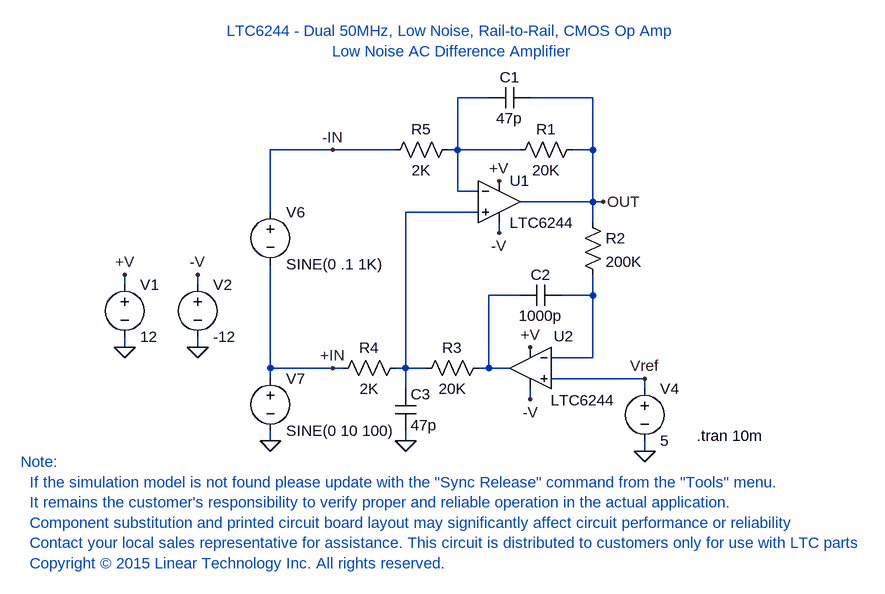
[diagram p0: schematic LTC6244_F11A.asc]
LTC6244_F11A.asc, the LTspice schematic file:
Version 4
SHEET 1 1080 868
WIRE 112 128 64 128
WIRE 272 128 176 128
WIRE -128 208 -224 208
WIRE -32 208 -128 208
WIRE 64 208 64 128
WIRE 64 208 48 208
WIRE 160 208 64 208
WIRE 272 208 272 128
WIRE 272 208 240 208
WIRE 64 272 64 208
WIRE 96 272 64 272
WIRE 272 288 272 208
WIRE 272 288 160 288
WIRE 288 288 272 288
WIRE -224 304 -224 208
WIRE 96 304 -16 304
WIRE 272 320 272 288
WIRE 128 336 128 320
WIRE -448 416 -448 400
WIRE -336 416 -336 400
WIRE 160 432 112 432
WIRE 272 432 272 400
WIRE 272 432 224 432
WIRE -448 512 -448 496
WIRE -336 512 -336 496
WIRE 272 528 272 432
WIRE 272 528 208 528
WIRE -224 544 -224 384
WIRE -128 544 -224 544
WIRE -112 544 -128 544
WIRE -16 544 -16 304
WIRE -16 544 -32 544
WIRE 16 544 -16 544
WIRE 112 544 112 432
WIRE 112 544 96 544
WIRE 144 544 112 544
WIRE -224 560 -224 544
WIRE 352 560 208 560
WIRE -16 576 -16 544
WIRE 352 576 352 560
WIRE 176 592 176 576
WIRE -224 656 -224 640
WIRE -16 656 -16 640
WIRE 352 672 352 656
FLAG -448 512 0
FLAG -336 512 0
FLAG -448 400 +V
FLAG -128 208 -IN
FLAG 288 288 OUT
FLAG 128 256 +V
FLAG -336 400 -V
FLAG 128 336 -V
FLAG 176 512 +V
FLAG 176 592 -V
FLAG -16 656 0
FLAG -128 544 +IN
FLAG 352 672 0
FLAG 352 560 Vref
FLAG -224 656 0
SYMBOL voltage -448 400 R0
WINDOW 123 0 0 Left 2
WINDOW 39 0 0 Left 2
SYMATTR InstName V1
SYMATTR Value 12
SYMBOL voltage -336 400 R0
WINDOW 123 0 0 Left 2
WINDOW 39 0 0 Left 2
SYMATTR InstName V2
SYMATTR Value -12
SYMBOL LTC6244 128 288 R0
SYMATTR InstName U1
SYMBOL LTC6244 176 544 M0
WINDOW 0 -67 -49 Left 2
WINDOW 3 -131 49 Left 2
SYMATTR InstName U2
SYMBOL res 256 192 R90
WINDOW 0 0 56 VBottom 2
WINDOW 3 32 56 VTop 2
SYMATTR InstName R1
SYMATTR Value 20K
SYMBOL res 256 304 R0
SYMATTR InstName R2
SYMATTR Value 200K
SYMBOL res 112 528 R90
WINDOW 0 0 56 VBottom 2
WINDOW 3 32 56 VTop 2
SYMATTR InstName R3
SYMATTR Value 20K
SYMBOL res -16 528 R90
WINDOW 0 0 56 VBottom 2
WINDOW 3 32 56 VTop 2
SYMATTR InstName R4
SYMATTR Value 2K
SYMBOL cap 176 112 R90
WINDOW 0 0 32 VBottom 2
WINDOW 3 32 32 VTop 2
SYMATTR InstName C1
SYMATTR Value 47p
SYMBOL cap 224 416 R90
WINDOW 0 0 32 VBottom 2
WINDOW 3 32 32 VTop 2
SYMATTR InstName C2
SYMATTR Value 1000p
SYMBOL cap -32 576 R0
SYMATTR InstName C3
SYMATTR Value 47p
SYMBOL res 64 192 R90
WINDOW 0 0 56 VBottom 2
WINDOW 3 32 56 VTop 2
SYMATTR InstName R5
SYMATTR Value 2K
SYMBOL voltage 352 560 R0
WINDOW 123 0 0 Left 2
WINDOW 39 0 0 Left 2
SYMATTR InstName V4
SYMATTR Value 5
SYMBOL voltage -224 288 R0
WINDOW 123 0 0 Left 2
WINDOW 39 24 44 Left 2
SYMATTR InstName V6
SYMATTR Value SINE(0 .1 1K)
SYMBOL voltage -224 544 R0
WINDOW 123 24 126 Left 2
WINDOW 39 24 111 Left 2
SYMATTR InstName V7
SYMATTR Value SINE(0 10 100)
TEXT 432 648 Left 2 !.tran 10m
TEXT 56 72 Bottom 2 ;LTC6244 - Dual 50MHz, Low Noise, Rail-to-Rail, CMOS Op Amp\nLow Noise AC Difference Amplifier
TEXT -608 688 Left 2 ;Note:\n  If the simulation model is not found please update with the "Sync Release" command from the "Tools" menu.\n  It remains the customer's responsibility to verify proper and reliable operation in the actual application.\n  Component substitution and printed circuit board layout may significantly affect circuit performance or reliability\n  Contact your local sales representative for assistance. This circuit is distributed to customers only for use with LTC parts\n  Copyright © 2015 Linear Technology Inc. All rights reserved.

The netlist it stands for:
* LTC6244_F11A.asc
V1 +V 0 12
V2 -V 0 -12
XU1 N002 N001 +V -V OUT LTC6244  ; pins In+ In- V+ V- OUT
XU2 Vref N004 +V -V N003 LTC6244  ; pins In+ In- V+ V- OUT
R1 OUT N001 20K
R2 OUT N004 200K
R3 N003 N002 20K
R4 N002 +IN 2K
C1 OUT N001 47p
C2 N004 N003 1000p
C3 N002 0 47p
R5 N001 -IN 2K
V4 Vref 0 5
V6 -IN +IN SINE(0 .1 1K)
V7 +IN 0 SINE(0 10 100)
.tran 10m
* LTC6244 - Dual 50MHz, Low Noise, Rail-to-Rail, CMOS Op Amp
* Low Noise AC Difference Amplifier
* Note:
*   If the simulation model is not found please update with the "Sync Release" command from the "Tools" menu.
*   It remains the customer's responsibility to verify proper and reliable operation in the actual application.
*   Component substitution and printed circuit board layout may significantly affect circuit performance or reliability
*   Contact your local sales representative for assistance. This circuit is distributed to customers only for use with LTC parts
*   Copyright © 2015 Linear Technology Inc. All rights reserved.
.backanno
.end